# Altium schematic sheet AnalogInputs.SchDoc
size A3; SheetNumber: 7; SheetTotal: 11
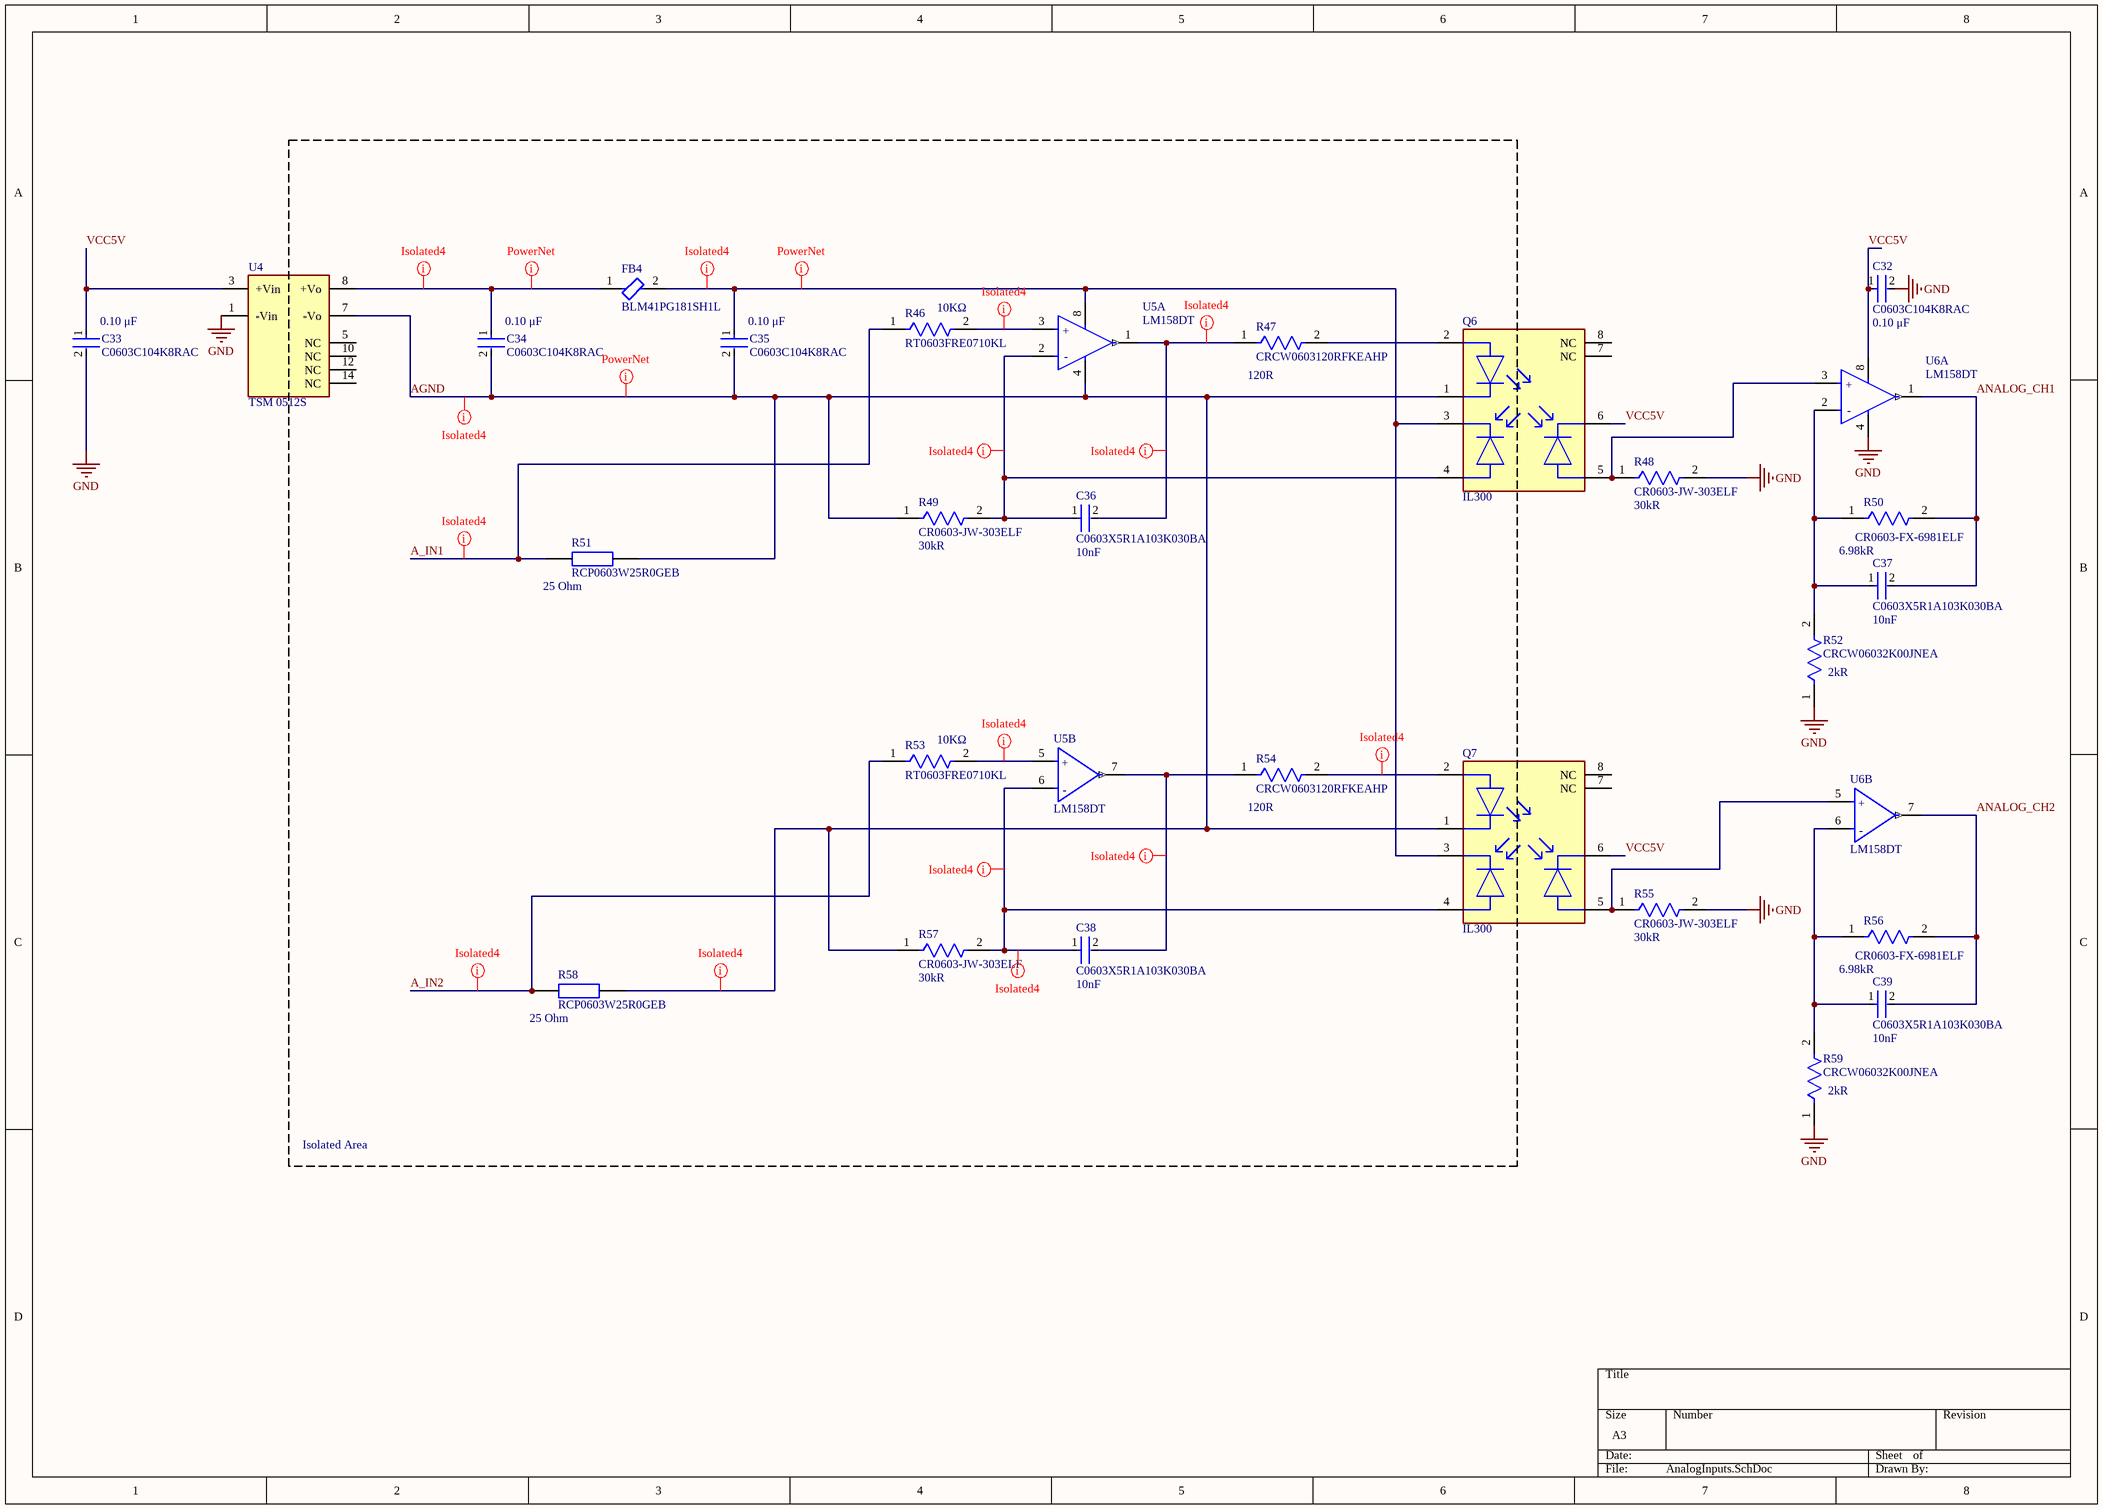
[diagram p0: AnalogInputs.SchDoc]

## Parts
C32  C0603C104K8RAC  Capacitance: 0.10 μF  [FP-C0603C-CF-MFG]
C33  C0603C104K8RAC  Capacitance: 0.10 μF  [FP-C0603C-CF-MFG]
C34  C0603C104K8RAC  Capacitance: 0.10 μF  [FP-C0603C-CF-MFG]
C35  C0603C104K8RAC  Capacitance: 0.10 μF  [FP-C0603C-CF-MFG]
C36  C0603X5R1A103K030BA  Capacitance: 10nF  [FP-C0603-030-0_03-MFG]
C37  C0603X5R1A103K030BA  Capacitance: 10nF  [FP-C0603-030-0_03-MFG]
C38  C0603X5R1A103K030BA  Capacitance: 10nF  [FP-C0603-030-0_03-MFG]
C39  C0603X5R1A103K030BA  Capacitance: 10nF  [FP-C0603-030-0_03-MFG]
FB4  BLM41PG181SH1L  [FP-BLM41-0_2-a1_2-MFG]
Q6  IL300  [FP-83265-MFG]
Q7  IL300  [FP-83265-MFG]
R46  RT0603FRE0710KL  value 10KΩ  [FP-RT0603-MFG]
R47  CRCW0603120RFKEAHP  Resistance: 120R  [FP-CRCW0603-HPe3-MFG]
R48  CR0603-JW-303ELF  Resistance: 30kR  [FP-CR0603-MFG]
R49  CR0603-JW-303ELF  Resistance: 30kR  [FP-CR0603-MFG]
R50  CR0603-FX-6981ELF  Resistance: 6.98kR  [FP-CR0603-IPC_B]
R51  RCP0603W25R0GEB  Resistance: 25 Ohm  [RESC1608X59N]
R52  CRCW06032K00JNEA  Resistance: 2kR  [FP-CRCW0603-e3-MFG]
R53  RT0603FRE0710KL  value 10KΩ  [FP-RT0603-MFG]
R54  CRCW0603120RFKEAHP  Resistance: 120R  [FP-CRCW0603-HPe3-MFG]
R55  CR0603-JW-303ELF  Resistance: 30kR  [FP-CR0603-MFG]
R56  CR0603-FX-6981ELF  Resistance: 6.98kR  [FP-CR0603-IPC_B]
R57  CR0603-JW-303ELF  Resistance: 30kR  [FP-CR0603-MFG]
R58  RCP0603W25R0GEB  Resistance: 25 Ohm  [RESC1608X59N]
R59  CRCW06032K00JNEA  Resistance: 2kR  [FP-CRCW0603-e3-MFG]
U4  TSM 0512S  [FP-TSM_0512S-MFG]
U5  LM158DT  [FP-SO8-IPC_C]  (parts A,B of 2)
U6  LM158DT  [FP-SO8-IPC_C]  (parts A,B of 2)

## Blocks framed on the sheet
Isolated Area: C34-C36 C38 FB4 R46 R47 R49 R51 R53 R54 R57 R58 U4 U5

## Nets
GND: C32.2 C33.2 R48.2 R52.1 R55.2 R59.1 U4.1(-Vin) U6.4(Vcc-)
A_IN1: R46.1 R51.1
A_IN2: R53.1 R58.1
AGND: C34.2 C35.2 Q6.1(1_CATHODE) Q7.1(1_CATHODE) R49.1 R51.2 R57.1 R58.2 U4.7(-Vo) U5.4(Vcc-)
ANALOG_CH1: C37.2 R50.2 U6.1(Out1)
ANALOG_CH2: C39.2 R56.2 U6.7(Out2)
VCC5V: C32.1 C33.1 Q6.6(3_CATHODE) Q7.6(3_CATHODE) U4.3(+Vin) U6.8(Vcc+)
NetC34_1: C34.1 FB4.1 U4.8(+Vo)
NetC35_1: C35.1 FB4.2 Q6.3(2_CATHODE) Q7.3(2_CATHODE) U5.8(Vcc+)
NetC36_1: C36.1 Q6.4(2_ANODE) R49.2 U5.2(In1-)
NetC36_2: C36.2 R47.1 U5.1(Out1)
NetC37_1: C37.1 R50.1 R52.2 U6.2(In1-)
NetC38_1: C38.1 Q7.4(2_ANODE) R57.2 U5.6(In2-)
NetC38_2: C38.2 R54.1 U5.7(Out2)
NetC39_1: C39.1 R56.1 R59.2 U6.6(In2-)
NetQ6_2: Q6.2(1_ANODE) R47.2
NetQ6_5: Q6.5(3_ANODE) R48.1 U6.3(In1+)
NetQ7_2: Q7.2(1_ANODE) R54.2
NetQ7_5: Q7.5(3_ANODE) R55.1 U6.5(In2+)
NetR46_2: R46.2 U5.3(In1+)
NetR53_2: R53.2 U5.5(In2+)

Not connected (* = marked no-connect by the designer): Q6 7(NC) 8(NC); Q7 7(NC) 8(NC); U4 5(NC) 10(NC) 12(NC) 14(NC)

## Layout directives
net class Isolated4: A_IN1, A_IN2, AGND, NetC34_1, NetC35_1, NetC36_1, NetC36_2, NetC38_1, NetC38_2, NetQ7_2, NetR46_2, NetR53_2
net class Power: AGND, NetC34_1, NetC35_1

## Notes on the sheet
- (in symbol CMP-2000-06544-2, part A) +; -
- (in symbol CMP-2000-06544-2, part B) +; -

## Library data of the parts
C32-C35 = CMP-03020-006081-2: C0603 0.10 μF X7R 30ppm/°C 10.00% 10 V; Manufacturer: KEMET; Value: 0.10 μF; Material: Ceramic; Automotive Grade: Grade 1; Voltage Rating: 10 V; Tolerance: 0.1; Automotive: Yes; Device Class L2: Capacitors; Height: 0.87mm; Temperature Range High: +125°C; Temperature Coefficient: 30ppm/°C; Temperature Range Low: -55°C; Package: C0603C-CF; Lead Free: Yes; Octopart: https://octopart.com/c0603c104k8rac-kemet-1325403; Manufacturer Part Number: C0603C104K8RAC; Temperature: -55°C to +125°C; Mouser Description: .1UF 10V 10% 0603; RoHS: TRUE; ComponentLink2URL: https://api.kemet.com/component-edge/download/datasheet/C0603C100J5GACAUTO.pdf; ComponentLink2Description: Datasheet; Temperature Characteristic: X7R; Device Class L1: Passive Components; Category: Cap; Device Class L3: Ceramic Capacitors
C36-C39 = CMP-08246-002714-1: Multilayer Ceramic Capacitors 10nF ±10% 10V X5R SMD 0201; Dissipation Factor: 5%; Case Code (Imperial): 0201; Tolerance: 10%; Voltage: 10V; Case/Package: 0201; Width: 0.012inch; Series: C; Construction: Flat; Lead Free: Lead Free; Dielectric: X5R; Depth: 0.3mm; Mount: Surface Mount; Number of Pins: 2; Voltage Rating (DC): 10V; Radiation Hardening: No; Length: 0.6mm; Resistor Type: Ceramic; Dielectric Material: Ceramic; Packaging: Tape and Reel; Height: 0.3mm; Package Quantity: 1; RoHS Compliant: Yes; Thickness: 0.013inch; Min Operating Temperature: -55°C; Voltage Rating: 10V; Case Code (Metric): 0603; Weight: 6E-06oz; Max Operating Temperature: 85°C; Termination: SMD/SMT
FB4 = CMP-06046-002023-1: Ferrite Bead, 1806, 180Ω @ 100MHz, 25%, 0.02Ω, 3.5A; Impedance: 180R; Number of Lines: 1; Max DC Current: 50mA; DC Resistance (DCR): 20mR; Mount: Surface Mount; Length: 4.5mm; Tolerance: 25%; Series: EMIFIL®, BLM41P; Package Quantity: 2500; Min Operating Temperature: -55°C; Max Operating Temperature: 125°C; Height: 0.071inch; Packaging: Tape and Reel; Contact Plating: Tin; Test Frequency: 100MHz; Ratings: AEC-Q200; Case Code (Metric): 4516; Termination: SMD/SMT; Case Code (Imperial): 1806; Width: 0.063inch; Max Current Rating: 3.5A; Case/Package: 1806
Q6 Q7 = CMP-2000-06452-2: OPTOISO 5.3KV LINEAR PHVOLT 8DIP; Manufacturer: Vishay; Standoff Height: 0.527mm; Forward Current: 10mA; Isolation Voltage: 4420Vrms; Forward Voltage: 1.25V; Reverse Voltage: 5V; Power Dissipation: 210mW; Max Junction Temp: +100°C; Temperature: to +100°C; Height: 4.699mm; Manufacturer Part Number: IL300; Automotive: No; Device Class L2: Optocouplers; Octopart: https://octopart.com/il300-vishay-39692656; ComponentLink2Description: Datasheet; Footprint Url: http://www.vishay.com/docs/83265/83265.pdf; Device Class L1: Optoelectronics; ComponentLink2URL: https://www.vishay.com/docs/83622/il300.pdf; RoHS: TRUE; Device Class L3: unset; Ipc Land Pattern Name: DIP762W51P254L1016H426Q8; Ambient Temperature Range Low: -55°C; Lead Free: Yes; Package: 83265; Ambient Temperature Range High: +100°C; Category: Trans; Digikey Description: OPTOISO 5.3KV LINEAR PHVOLT 8DIP; Temperature Range High: +100°C; Mouser Description: Optocoupler DC-IN 1-CH Linear Photovoltaic DC-OUT 8-Pin PDIP-8A
R46 R53 = CMP-03412-005349-1: RES SMD 10K OHM 1% 1/10W 0603; Manufacturer: Yageo; Temperature Coefficient: 50 ppm/°C; Power Rating: 0.1W; Tolerance: 0.01; Voltage Rating: 75V; RoHS: TRUE; Category: Res; Automotive: No; Digikey Description: RES SMD 10K OHM 1% 1/10W 0603; ComponentLink2Description: Datasheet; Octopart: https://octopart.com/rt0603fre0710kl-yageo-40009243; ComponentLink2URL: http://www.yageo.com/documents/recent/PYu-RT_1-to-0.01_RoHS_L_9.pdf; Device Class L3: Chip SMD Resistors; Device Class L1: Passive Components; Temperature Range High: +155°C; Height: 0.55mm; Composition: Thin Film; Ipc Land Pattern Name: RESC16080X45; Series: RT; Package: RT0603; Resistance: 10KΩ; Footprint Url: http://www.yageo.com/exep/pages/download/literatures/PYu-R_Mount_10.pdf; Temperature: -55°C to +155°C; Temperature Range Low: -55°C; Lead Free: Yes; Device Class L2: Resistors; Mouser Description: Thin Film Resistors - SMD 10K ohm 1% 1/10W; Manufacturer Part Number: RT0603FRE0710KL
R47 R54 = CMP-02407-008828-1: RES Thick Film, 120Ω, 1%, 0.33W, 100ppm/°C, 0603; Max Power Dissipation: 250mW; Voltage Rating: 75V; Military Standard: Not; Case Code (Metric): 1608; Depth: 0.85mm; Case Code (Imperial): 0603; Composition: Thick Film; Power Rating: 250mW; Number of Terminations: 2; Max Operating Temperature: 155°C; Temperature Coefficient: 100ppm/°C; Tolerance: 1%; Radiation Hardening: No; Width: 0.033inch; Min Operating Temperature: -55°C; Height: 0.022inch; Termination: SMD/SMT; Features: Automotive AEC-Q200; Length: 1.6mm; Package Quantity: 5000; Packaging: Tape and Reel; Case/Package: 0603; Contact Plating: Tin
R48 R49 R55 R57 = CMP-07231-001566-1: Thick Film Chip Resistors 0603 30kΩ 0.1W 5% 200ppm/°C; Max Power Dissipation: 100mW; Voltage Rating: 50V; Tolerance: 5%; Min Operating Temperature: -55°C; Height: 0.022inch; Depth: 0.8mm; Termination: SMD/SMT; Max Operating Temperature: 155°C; Contact Plating: Tin; Power Rating: 100mW; Width: 0.8mm; Packaging: Tape and Reel; Case Code (Imperial): 0603; Thickness: 457um; Package Quantity: 5000; Radiation Hardening: No; Temperature Coefficient: 200ppm/°C; Case/Package: 0603; Composition: Thick Film; Case Code (Metric): 1608; Length: 1.6mm; Number of Terminations: 2; Mount: Surface Mount; Military Standard: Not; Features: Moisture Resistant
R50 R56 = CMP-07231-001360-1: Thick Film Chip Resistors 0603 6.98kΩ 0.1W 1% 100ppm/°C; Power Rating: 100mW; Voltage Rating: 50V; Depth: 0.8mm; Package Quantity: 5000; Number of Terminations: 2; Case Code (Metric): 1608; Radiation Hardening: No; Width: 0.031inch; Packaging: Tape and Reel; Termination: SMD/SMT; Mount: Surface Mount; Features: Moisture Resistant; Composition: Thick Film; Min Operating Temperature: -55°C; Case Code (Imperial): 0603; Height: 0.022inch; Length: 1.6mm; Thickness: 457um; Max Operating Temperature: 155°C; Contact Plating: Tin; Tolerance: 1%; Temperature Coefficient: 100ppm/°C; Case/Package: 0603; Max Power Dissipation: 100mW; Military Standard: Not
R51 R58 = RCP0603W25R0GEB: Vishay 25 0603 (1608M) Thick Film SMD Resistor +/-2% 1.5W - RCP0603W25R0GEB; Geometry.Height: 0.59mm; Mouser Part Number: *; Mouser Price/Stock: *; Manufacturer_Name: Vishay; Manufacturer_Part_Number: RCP0603W25R0GEB; Datasheet Link: *
R52 R59 = CMP-2000-03163-2: RES Thick Film, 2kΩ, 5%, 0.1W, 200ppm/°C, 0603; Power Rating: 100mW; Working Voltage: 75V; Min Operating Temperature: -55°C; Package Quantity: 1; Contact Plating: Tin; Number of Terminations: 2; Depth: 0.85mm; Radiation Hardening: No; Weight: 7.1E-05oz; Case Code (Imperial): 0603; Tolerance: 5%; Length: 1.55mm; Temperature Coefficient: 200ppm/°C; Width: 0.033inch; Mount: Surface Mount; Case Code (Metric): 1608; Voltage Rating: 75V; Height: 0.45mm; Case/Package: 0603; Military Standard: Not; Features: Automotive AEC-Q200; Number of Pins: 2; Lead Free: Lead Free; Composition: Thick Film; Packaging: Tape and Reel; Max Operating Temperature: 155°C; Voltage Rating (DC): 75V; Max Power Dissipation: 100mW; Termination: SMD/SMT
U4 = CMP-49942-000007-1: DC DC CONVERTER 12V 960MW; Manufacturer: Tracopower; Nominal Supply Current: 110mA; Switching Topology: Boost; Min Supply Voltage: 4.5V; Switching Frequency: 100kHz; Output Type: Fixed; Standoff Height: 0mm; Number Of Outputs: 1; Output Current: 80mA; Max Supply Voltage: 5.5V; Octopart: https://octopart.com/tsm+0512s-tracopower-7394392; Manufacturer Part Number: TSM 0512S; ComponentLink2URL: https://docs.rs-online.com/a71b/0900766b816ed9c3.pdf; Lead Free: Yes; Temperature: -40°C to +85°C; Device Class L3: Voltage Regulators - Switching; Output Voltage: 12V; Temperature Range High: +85°C; Height: 7.55mm; RoHS: TRUE; Device Class L2: Power Management ICs; Digikey Description: DC DC CONVERTER 12V 960MW; ComponentLink2Description: Datasheet; Automotive: No; Category: IC; Temperature Range Low: -40°C; Device Class L1: Integrated Circuits (ICs); Package: 0
U5 U6 = CMP-2000-06544-2: IC OPAMP GP 2 CIRCUIT 8SO; Manufacturer: STMicroelectronics; Standoff Height: 0.1mm; Input Offset Voltage: 2mV; Output Current Per Channel: 40mA; Max Dual Supply Voltage: 15V; Max Supply Voltage: 30V; Nominal Supply Current: 50-20000uA; Input Bias Current: 0.02uA; Min Dual Supply Voltage: 1.5V; Min Supply Voltage: 3V; Voltage Gain: 100V/mV; Number Of Channels: 2; Max Junction Temp: +150°C; Lead Free: Yes; Device Class L2: Linear ICs; Temperature Range Low: -55°C; RoHS: TRUE; Temperature Range High: +125°C; Automotive: No; Height: 1.75mm; Device Class L1: Integrated Circuits (ICs); Mouser Description: Operational Amplifiers - Op Amps Low PWR Dual OP AMP 100dB 1.1 MHz 20nA; Temperature: -55°C to +125°C; Digikey Description: IC OPAMP GP 2 CIRCUIT 8SO; Device Class L3: Amplifiers - Op Amps; Manufacturer Part Number: LM158DT; ComponentLink2Description: Datasheet; Package: SO8; ComponentLink2URL: https://www.st.com/content/ccc/resource/technical/document/datasheet/61/46/87/01/98/ed/44/c5/CD00000464.pdf/files/CD00000464.pdf/jcr:content/translations/en.CD00000464.pdf; Octopart: https://octopart.com/lm158dt-stmicroelectronics-11026426